# Altium schematic sheet Underwater_ROV_RPI.SchDoc
size A
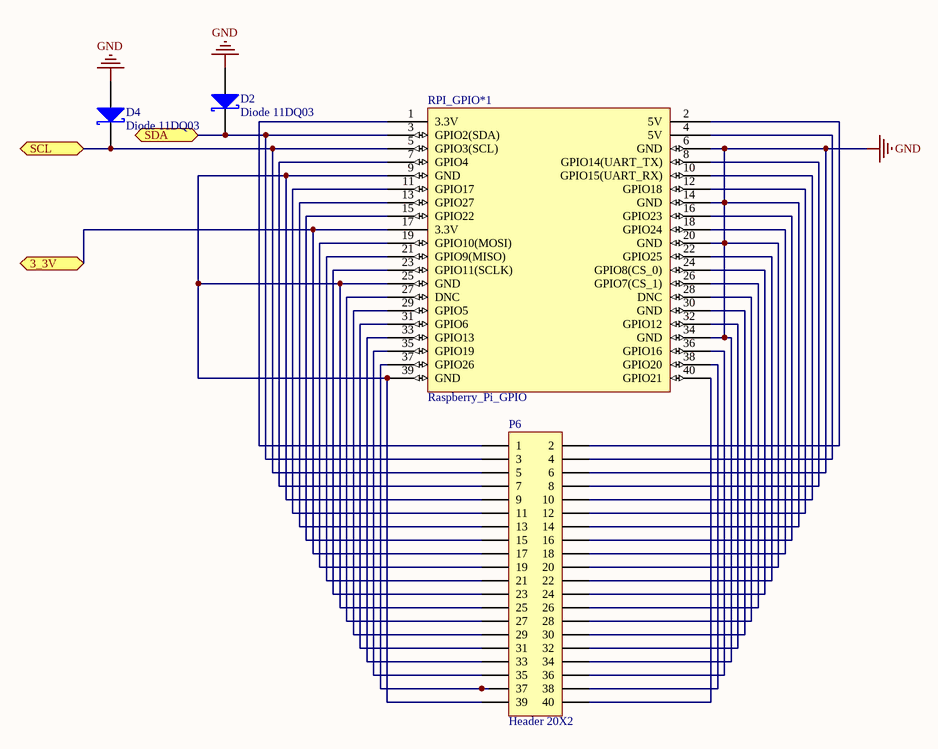
[diagram p0: Underwater_ROV_RPI.SchDoc]

## Parts
D2  Diode 11DQ03  [DO-204AL]
D4  Diode 11DQ03  [DO-204AL]
P6  Header 20X2  [HDR2X20]
RPI_GPIO*1  Raspberry_Pi_GPIO  [HDR2X20]

## Ports
3_3V (bidir), SCL (bidir), SDA (bidir)

## Nets
GND: D2.1(A) D4.1(A) P6.6 P6.14 P6.20 P6.34 RPI_GPIO*1.6(GND) RPI_GPIO*1.14(GND) RPI_GPIO*1.20(GND) RPI_GPIO*1.34(GND)
3_3V: P6.17 RPI_GPIO*1.17(3.3V) ; port 3_3V
SCL: D4.2(K) P6.5 RPI_GPIO*1.5(GPIO3(SCL)) ; port SCL
SDA: D2.2(K) P6.3 RPI_GPIO*1.3(GPIO2(SDA)) ; port SDA
NetP6_1: P6.1 RPI_GPIO*1.1(3.3V)
NetP6_2: P6.2 RPI_GPIO*1.2(5V)
NetP6_4: P6.4 RPI_GPIO*1.4(5V)
NetP6_7: P6.7 RPI_GPIO*1.7(GPIO4)
NetP6_8: P6.8 RPI_GPIO*1.8(GPIO14(UART_TX))
NetP6_9: P6.9 P6.25 P6.39 RPI_GPIO*1.9(GND) RPI_GPIO*1.25(GND) RPI_GPIO*1.39(GND)
NetP6_10: P6.10 RPI_GPIO*1.10(GPIO15(UART_RX))
NetP6_11: P6.11 RPI_GPIO*1.11(GPIO17)
NetP6_12: P6.12 RPI_GPIO*1.12(GPIO18)
NetP6_13: P6.13 RPI_GPIO*1.13(GPIO27)
NetP6_15: P6.15 RPI_GPIO*1.15(GPIO22)
NetP6_16: P6.16 RPI_GPIO*1.16(GPIO23)
NetP6_18: P6.18 RPI_GPIO*1.18(GPIO24)
NetP6_19: P6.19 RPI_GPIO*1.19(GPIO10(MOSI))
NetP6_21: P6.21 RPI_GPIO*1.21(GPIO9(MISO))
NetP6_22: P6.22 RPI_GPIO*1.22(GPIO25)
NetP6_23: P6.23 RPI_GPIO*1.23(GPIO11(SCLK))
NetP6_24: P6.24 RPI_GPIO*1.24(GPIO8(CS_0))
NetP6_26: P6.26 RPI_GPIO*1.26(GPIO7(CS_1))
NetP6_27: P6.27 RPI_GPIO*1.27(DNC)
NetP6_28: P6.28 RPI_GPIO*1.28(DNC)
NetP6_29: P6.29 RPI_GPIO*1.29(GPIO5)
NetP6_30: P6.30 RPI_GPIO*1.30(GND)
NetP6_31: P6.31 RPI_GPIO*1.31(GPIO6)
NetP6_32: P6.32 RPI_GPIO*1.32(GPIO12)
NetP6_33: P6.33 RPI_GPIO*1.33(GPIO13)
NetP6_35: P6.35 RPI_GPIO*1.35(GPIO19)
NetP6_36: P6.36 RPI_GPIO*1.36(GPIO16)
NetP6_37: P6.37 RPI_GPIO*1.37(GPIO26)
NetP6_38: P6.38 RPI_GPIO*1.38(GPIO20)
NetP6_40: P6.40 RPI_GPIO*1.40(GPIO21)

## Library data of the parts
D2 D4 = Diode 11DQ03: Schottky Rectifier; Published: 8-Jun-2000; LatestRevisionDate: 17-Jul-2002; LatestRevisionNote: Re-released for DXP Platform.; DatasheetVersion: Dec-1997; PackageReference: DO-204AL; Publisher: Altium Limited; PackageDescription: Diode, Axial; Body 5.2 x 2.7 mm (LxDia. max), Lead Dia. 0.86 mm (max); Code_JEDEC: DO-204-AL; ComponentLink1Description: Manufacturer Link; ComponentLink1URL: http://www.irf.com/; ComponentLink2Description: Datasheet; ComponentLink2URL: http://www.irf.com/product-info/datasheets/data/11dq03.pdf
P6 = Header 20X2: Header, 20-Pin, Dual row; LatestRevisionDate: 17-Jul-2002; LatestRevisionNote: Re-released for DXP Platform.; Publisher: Altium Limited